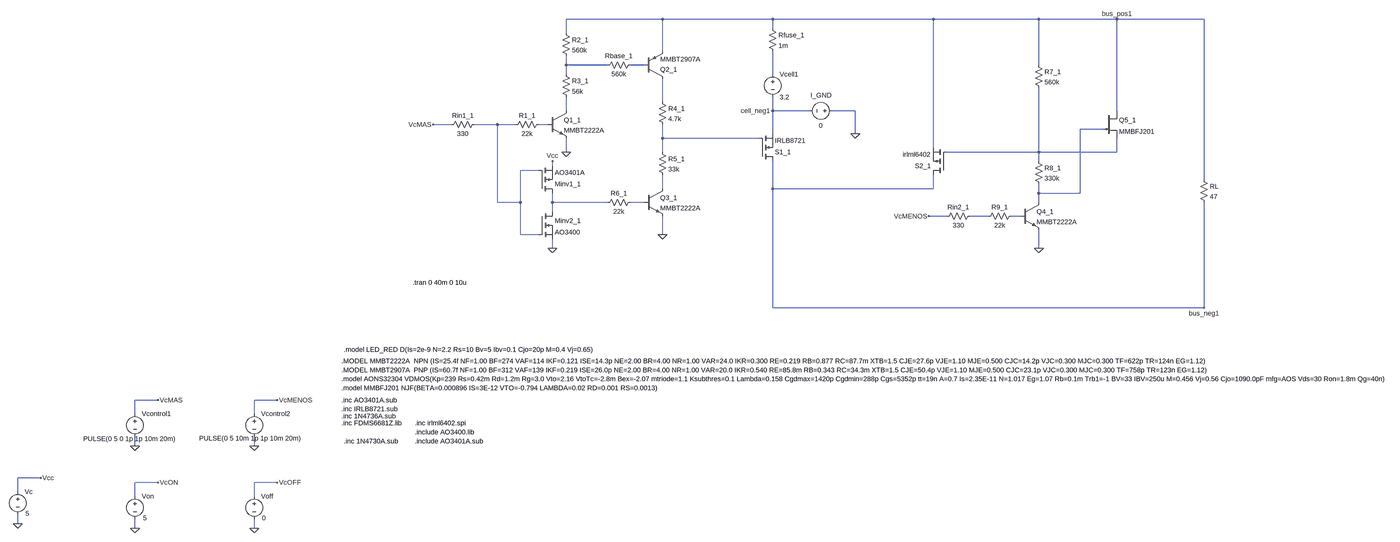
[diagram p0: schematic Pruebas aumentar cell_neg - 1 celda.asc, whole sheet]
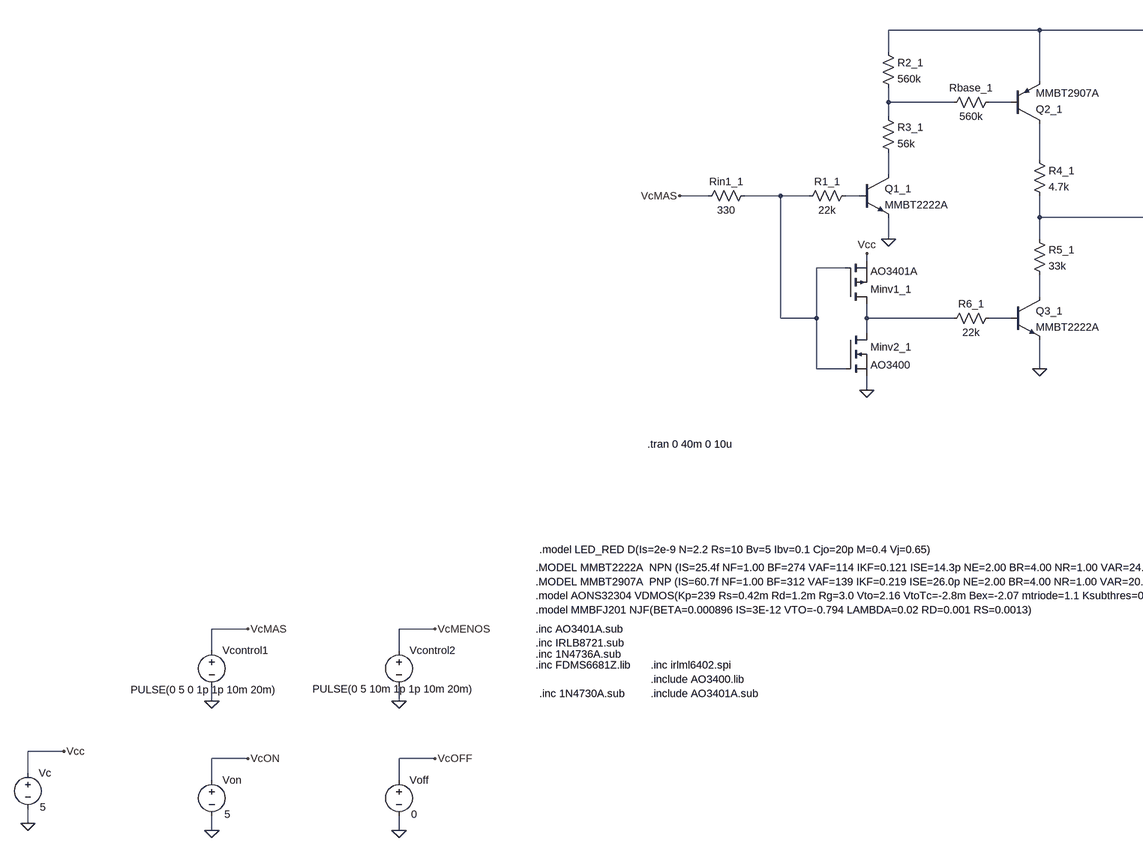
[diagram p1: schematic Pruebas aumentar cell_neg - 1 celda.asc, part, row 1 of 1, column 1 of 2]
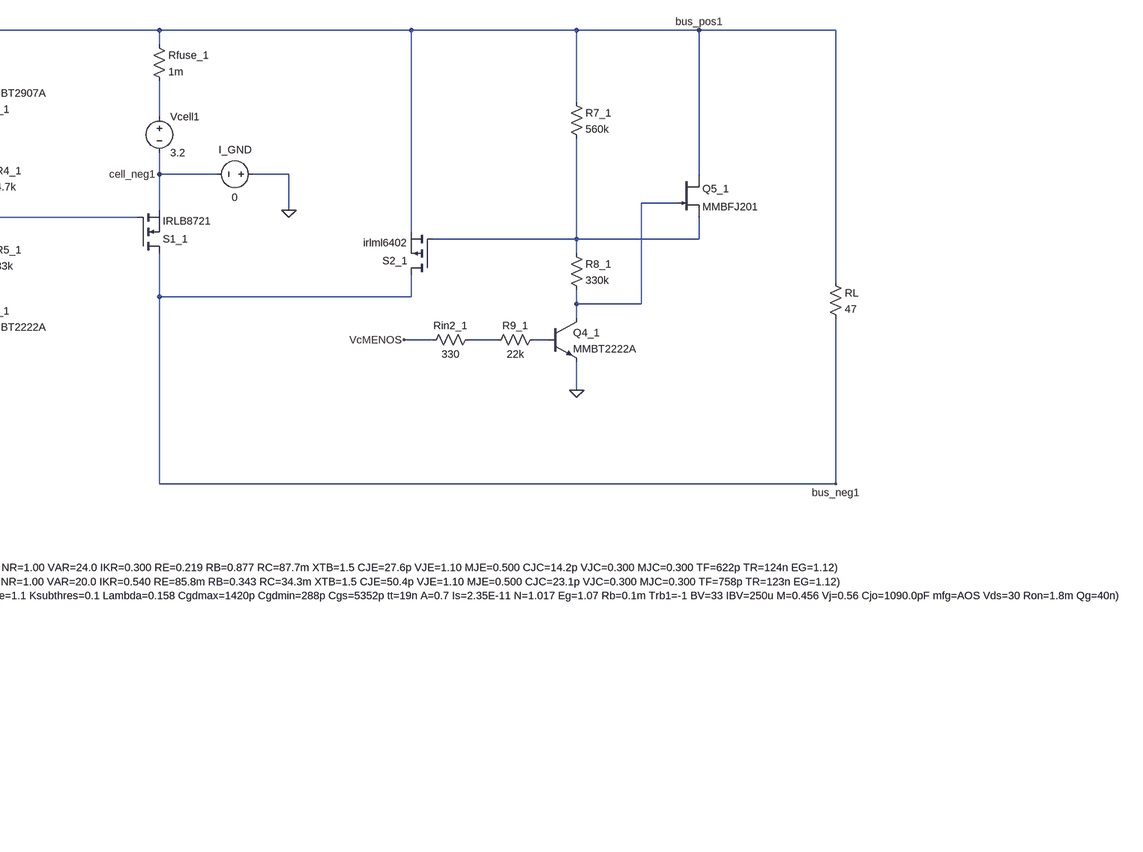
[diagram p2: schematic Pruebas aumentar cell_neg - 1 celda.asc, part, row 1 of 1, column 2 of 2]
Pruebas aumentar cell_neg - 1 celda.asc, the LTspice schematic file:
Version 4.1
SHEET 1 7672 2128
WIRE 896 -688 560 -688
WIRE 1280 -688 896 -688
WIRE 1840 -688 1280 -688
WIRE 2208 -688 1840 -688
WIRE 2480 -688 2208 -688
WIRE 2784 -688 2480 -688
WIRE 1280 -656 1280 -688
WIRE 560 -640 560 -688
WIRE 896 -576 896 -688
WIRE 560 -528 560 -560
WIRE 704 -528 560 -528
WIRE 832 -528 784 -528
WIRE 2208 -528 2208 -688
WIRE 560 -496 560 -528
WIRE 1280 -496 1280 -576
WIRE 896 -400 896 -480
WIRE 560 -368 560 -416
WIRE 1280 -368 1280 -416
WIRE 1408 -368 1280 -368
WIRE 1568 -368 1488 -368
WIRE 2480 -368 2480 -688
WIRE 160 -320 96 -320
WIRE 320 -320 240 -320
WIRE 384 -320 320 -320
WIRE 496 -320 464 -320
WIRE 2432 -304 2352 -304
WIRE 1280 -288 1280 -368
WIRE 1568 -288 1568 -368
WIRE 896 -272 896 -320
WIRE 1232 -272 896 -272
WIRE 1840 -240 1840 -688
WIRE 560 -224 560 -272
WIRE 896 -224 896 -272
WIRE 2208 -224 2208 -448
WIRE 2208 -224 1888 -224
WIRE 2480 -224 2480 -272
WIRE 2480 -224 2208 -224
WIRE 2208 -192 2208 -224
WIRE 512 -176 512 -192
WIRE 464 -160 400 -160
WIRE 2784 -128 2784 -688
WIRE 896 -96 896 -144
WIRE 1280 -96 1280 -192
WIRE 1840 -96 1840 -144
WIRE 1840 -96 1280 -96
WIRE 2208 -80 2208 -112
WIRE 2352 -80 2352 -304
WIRE 2352 -80 2208 -80
WIRE 320 -48 320 -320
WIRE 400 -48 400 -160
WIRE 400 -48 320 -48
WIRE 512 -48 512 -80
WIRE 704 -48 512 -48
WIRE 832 -48 784 -48
WIRE 2208 -48 2208 -80
WIRE 512 -16 512 -48
WIRE 1888 0 1824 0
WIRE 2032 0 1968 0
WIRE 2144 0 2112 0
WIRE 400 64 400 -48
WIRE 464 64 400 64
WIRE 896 64 896 0
WIRE 512 112 512 80
WIRE 2208 112 2208 48
WIRE 1280 320 1280 -96
WIRE 2784 320 2784 -48
WIRE 2784 320 1280 320
WIRE -1072 1024 -1152 1024
WIRE -656 1024 -736 1024
WIRE -1152 1072 -1152 1024
WIRE -736 1072 -736 1024
WIRE -1152 1184 -1152 1152
WIRE -736 1184 -736 1152
WIRE -1504 1296 -1584 1296
WIRE -1072 1312 -1152 1312
WIRE -656 1312 -736 1312
WIRE -1584 1344 -1584 1296
WIRE -1152 1360 -1152 1312
WIRE -736 1360 -736 1312
WIRE -1584 1456 -1584 1424
WIRE -1152 1472 -1152 1440
WIRE -736 1472 -736 1440
FLAG 560 -224 0
FLAG 896 64 0
FLAG -1152 1184 0
FLAG -736 1184 0
FLAG -1072 1024 VcMAS
FLAG -656 1024 VcMENOS
FLAG -736 1472 0
FLAG -656 1312 VcOFF
FLAG -1152 1472 0
FLAG -1072 1312 VcON
FLAG 96 -320 VcMAS
FLAG 2208 112 0
FLAG 1824 0 VcMENOS
FLAG -1584 1456 0
FLAG -1504 1296 Vcc
FLAG 512 112 0
FLAG 512 -192 Vcc
FLAG 1568 -288 0
FLAG 2784 320 bus_neg1
FLAG 1280 -368 cell_neg1
FLAG 2480 -688 bus_pos1
SYMBOL npn 832 -96 R0
SYMATTR InstName Q3_1
SYMATTR Value MMBT2222A
SYMBOL res 880 -240 R0
SYMATTR InstName R5_1
SYMATTR Value 33k
SYMBOL res 880 -416 R0
SYMATTR InstName R4_1
SYMATTR Value 4.7k
SYMBOL npn 496 -368 R0
SYMATTR InstName Q1_1
SYMATTR Value MMBT2222A
SYMBOL res 544 -512 R0
SYMATTR InstName R3_1
SYMATTR Value 56k
SYMBOL res 544 -656 R0
SYMATTR InstName R2_1
SYMATTR Value 560k
SYMBOL res 800 -64 R90
WINDOW 0 0 56 VBottom 2
WINDOW 3 32 56 VTop 2
SYMATTR InstName R6_1
SYMATTR Value 22k
SYMBOL voltage 1280 -512 R0
WINDOW 123 0 0 Left 0
WINDOW 39 0 0 Left 0
SYMATTR InstName Vcell1
SYMATTR Value 3.2
SYMBOL pnp 832 -480 M180
SYMATTR InstName Q2_1
SYMATTR Value MMBT2907A
SYMBOL nmos 1232 -192 M180
SYMATTR InstName S1_1
SYMATTR Value IRLB8721
SYMATTR Prefix X
SYMBOL voltage -1152 1056 R0
WINDOW 3 -180 103 Left 2
WINDOW 123 0 0 Left 0
WINDOW 39 0 0 Left 0
SYMATTR Value PULSE(0 5 0 1p 1p 10m 20m)
SYMATTR InstName Vcontrol1
SYMBOL voltage -736 1056 R0
WINDOW 3 -192 102 Left 2
WINDOW 123 0 0 Left 0
WINDOW 39 0 0 Left 0
SYMATTR Value PULSE(0 5 10m 1p 1p 10m 20m)
SYMATTR InstName Vcontrol2
SYMBOL voltage -736 1344 R0
WINDOW 3 27 92 Left 2
WINDOW 123 0 0 Left 0
WINDOW 39 0 0 Left 0
SYMATTR Value 0
SYMATTR InstName Voff
SYMBOL voltage -1152 1344 R0
WINDOW 3 28 92 Left 2
WINDOW 123 0 0 Left 0
WINDOW 39 0 0 Left 0
SYMATTR Value 5
SYMATTR InstName Von
SYMBOL res 480 -336 R90
WINDOW 0 0 56 VBottom 2
WINDOW 3 32 56 VTop 2
SYMATTR InstName R1_1
SYMATTR Value 22k
SYMBOL res 1264 -672 R0
SYMATTR InstName Rfuse_1
SYMATTR Value 1m
SYMBOL npn 2144 -48 R0
SYMATTR InstName Q4_1
SYMATTR Value MMBT2222A
SYMBOL res 2128 -16 R90
WINDOW 0 0 56 VBottom 2
WINDOW 3 32 56 VTop 2
SYMATTR InstName R9_1
SYMATTR Value 22k
SYMBOL res 2192 -544 R0
SYMATTR InstName R7_1
SYMATTR Value 560k
SYMBOL pmos 1888 -144 R180
SYMATTR InstName S2_1
SYMATTR Value irlml6402
SYMATTR Prefix X
SYMBOL res 2192 -208 R0
SYMATTR InstName R8_1
SYMATTR Value 330k
SYMBOL res 2768 -144 R0
SYMATTR InstName RL
SYMATTR Value 47
SYMBOL voltage -1584 1328 R0
WINDOW 3 27 92 Left 2
WINDOW 123 0 0 Left 0
WINDOW 39 0 0 Left 0
SYMATTR Value 5
SYMATTR InstName Vc
SYMBOL pmos 464 -80 M180
SYMATTR InstName Minv1_1
SYMATTR Value AO3401A
SYMATTR Prefix X
SYMBOL nmos 464 -16 R0
SYMATTR InstName Minv2_1
SYMATTR Value AO3400
SYMATTR Prefix X
SYMBOL njf 2432 -368 R0
SYMATTR InstName Q5_1
SYMATTR Value MMBFJ201
SYMBOL res 256 -336 R90
WINDOW 0 0 56 VBottom 2
WINDOW 3 32 56 VTop 2
SYMATTR InstName Rin1_1
SYMATTR Value 330
SYMBOL res 1984 -16 R90
WINDOW 0 0 56 VBottom 2
WINDOW 3 32 56 VTop 2
SYMATTR InstName Rin2_1
SYMATTR Value 330
SYMBOL res 800 -544 R90
WINDOW 0 0 56 VBottom 2
WINDOW 3 32 56 VTop 2
SYMATTR InstName Rbase_1
SYMATTR Value 560k
SYMBOL voltage 1504 -368 M270
WINDOW 0 39 55 VTop 2
WINDOW 3 -36 56 VBottom 2
SYMATTR InstName I_GND
SYMATTR Value 0
TEXT 24 232 Left 2 !.tran 0 40m 0 10u
TEXT -224 888 Left 2 !.MODEL MMBT2222A  NPN (IS=25.4f NF=1.00 BF=274 VAF=114 IKF=0.121 ISE=14.3p NE=2.00 BR=4.00 NR=1.00 VAR=24.0 IKR=0.300 RE=0.219 RB=0.877 RC=87.7m XTB=1.5 CJE=27.6p VJE=1.10 MJE=0.500 CJC=14.2p VJC=0.300 MJC=0.300 TF=622p TR=124n EG=1.12)\n.MODEL MMBT2907A  PNP (IS=60.7f NF=1.00 BF=312 VAF=139 IKF=0.219 ISE=26.0p NE=2.00 BR=4.00 NR=1.00 VAR=20.0 IKR=0.540 RE=85.8m RB=0.343 RC=34.3m XTB=1.5 CJE=50.4p VJE=1.10 MJE=0.500 CJC=23.1p VJC=0.300 MJC=0.300 TF=758p TR=123n EG=1.12)\n.model AONS32304 VDMOS(Kp=239 Rs=0.42m Rd=1.2m Rg=3.0 Vto=2.16 VtoTc=-2.8m Bex=-2.07 mtriode=1.1 Ksubthres=0.1 Lambda=0.158 Cgdmax=1420p Cgdmin=288p Cgs=5352p tt=19n A=0.7 Is=2.35E-11 N=1.017 Eg=1.07 Rb=0.1m Trb1=-1 BV=33 IBV=250u M=0.456 Vj=0.56 Cjo=1090.0pF mfg=AOS Vds=30 Ron=1.8m Qg=40n)\n.model MMBFJ201 NJF(BETA=0.000896 IS=3E-12 VTO=-0.794 LAMBDA=0.02 RD=0.001 RS=0.0013)
TEXT -224 1024 Left 2 !.inc AO3401A.sub\n.inc IRLB8721.sub
TEXT -224 1080 Left 2 !.inc 1N4736A.sub
TEXT -224 1104 Left 2 !.inc FDMS6681Z.lib
TEXT -216 1168 Left 2 !.inc 1N4730A.sub
TEXT -216 848 Left 2 !.model LED_RED D(Is=2e-9 N=2.2 Rs=10 Bv=5 Ibv=0.1 Cjo=20p M=0.4 Vj=0.65)
TEXT 32 1104 Left 2 !.inc irlml6402.spi
TEXT 32 1136 Left 2 !.include AO3400.lib
TEXT 32 1168 Left 2 !.include AO3401A.sub

The netlist it stands for:
* Pruebas aumentar cell_neg - 1 celda.asc
Q3_1 N011 N013 0 0 MMBT2222A
R5_1 N009 N011 33k
R4_1 N004 N009 4.7k
Q1_1 N005 N007 0 0 MMBT2222A
R3_1 N001 N005 56k
R2_1 bus_pos1 N001 560k
R6_1 N013 N012 22k
Vcell1 N003 cell_neg1 3.2
Q2_1 N004 N002 bus_pos1 0 MMBT2907A
X§S1_1 bus_neg1 N009 cell_neg1 IRLB8721  ; pins D G S
Vcontrol1 VcMAS 0 PULSE(0 5 0 1p 1p 10m 20m)
Vcontrol2 VcMENOS 0 PULSE(0 5 10m 1p 1p 10m 20m)
Voff VcOFF 0 0
Von VcON 0 5
R1_1 N007 N006 22k
Rfuse_1 bus_pos1 N003 1m
Q4_1 N008 N015 0 0 MMBT2222A
R9_1 N015 N014 22k
R7_1 bus_pos1 N010 560k
X§S2_1 bus_neg1 N010 bus_pos1 irlml6402  ; pins D G S
R8_1 N010 N008 330k
RL bus_pos1 bus_neg1 47
Vc Vcc 0 5
X§Minv1_1 N012 N006 Vcc AO3401A  ; pins D G S
X§Minv2_1 N012 N006 0 AO3400  ; pins D G S
J§Q5_1 bus_pos1 N008 N010 MMBFJ201
Rin1_1 N006 VcMAS 330
Rin2_1 N014 VcMENOS 330
Rbase_1 N002 N001 560k
V§I_GND 0 cell_neg1 0
.model NPN NPN
.model PNP PNP
.lib standard.bjt
.model NJF NJF
.model PJF PJF
.lib standard.jft
.tran 0 40m 0 10u
.MODEL MMBT2222A  NPN (IS=25.4f NF=1.00 BF=274 VAF=114 IKF=0.121 ISE=14.3p NE=2.00 BR=4.00 NR=1.00 VAR=24.0 IKR=0.300 RE=0.219 RB=0.877 RC=87.7m XTB=1.5 CJE=27.6p VJE=1.10 MJE=0.500 CJC=14.2p VJC=0.300 MJC=0.300 TF=622p TR=124n EG=1.12)
.MODEL MMBT2907A  PNP (IS=60.7f NF=1.00 BF=312 VAF=139 IKF=0.219 ISE=26.0p NE=2.00 BR=4.00 NR=1.00 VAR=20.0 IKR=0.540 RE=85.8m RB=0.343 RC=34.3m XTB=1.5 CJE=50.4p VJE=1.10 MJE=0.500 CJC=23.1p VJC=0.300 MJC=0.300 TF=758p TR=123n EG=1.12)
.model AONS32304 VDMOS(Kp=239 Rs=0.42m Rd=1.2m Rg=3.0 Vto=2.16 VtoTc=-2.8m Bex=-2.07 mtriode=1.1 Ksubthres=0.1 Lambda=0.158 Cgdmax=1420p Cgdmin=288p Cgs=5352p tt=19n A=0.7 Is=2.35E-11 N=1.017 Eg=1.07 Rb=0.1m Trb1=-1 BV=33 IBV=250u M=0.456 Vj=0.56 Cjo=1090.0pF mfg=AOS Vds=30 Ron=1.8m Qg=40n)
.model MMBFJ201 NJF(BETA=0.000896 IS=3E-12 VTO=-0.794 LAMBDA=0.02 RD=0.001 RS=0.0013)
.inc AO3401A.sub
.inc IRLB8721.sub
.inc 1N4736A.sub
.inc FDMS6681Z.lib
.inc 1N4730A.sub
.model LED_RED D(Is=2e-9 N=2.2 Rs=10 Bv=5 Ibv=0.1 Cjo=20p M=0.4 Vj=0.65)
.inc irlml6402.spi
.include AO3400.lib
.include AO3401A.sub
.backanno
.end